# EAGLE design vga (EAGLE 6.5.0)
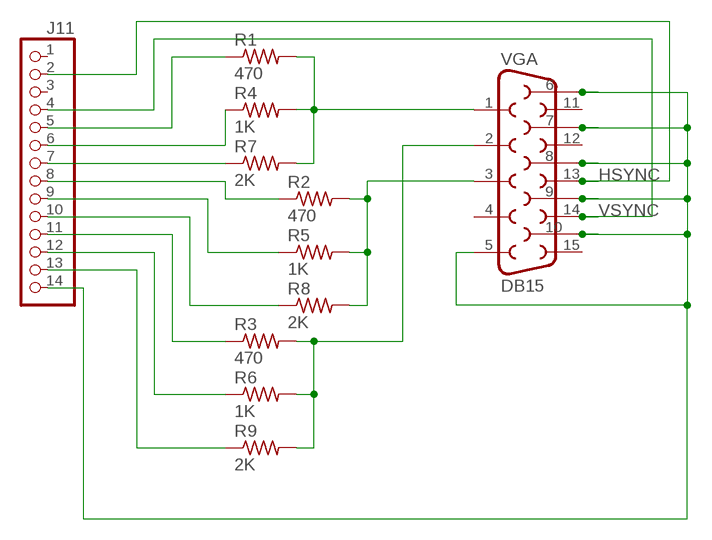
[diagram p0: schematic, sheet 1]

## Parts
J11  PINHD-1X14  [1X14]
R1  470  R-US_R0805  [R0805]
R2  470  R-US_R0805  [R0805]
R3  470  R-US_R0805  [R0805]
R4  1K  R-US_R0805  [R0805]
R5  1K  R-US_R0805  [R0805]
R6  1K  R-US_R0805  [R0805]
R7  2K  R-US_R0805  [R0805]
R8  2K  R-US_R0805  [R0805]
R9  2K  R-US_R0805  [R0805]
VGA  DB15  [DB15]

## Nets
BLUE: R3.2 R6.2 R9.2 VGA.2
EXT1: J11.5 R1.1
EXT7: J11.6 R4.1
EXT13: J11.8 R2.1
EXT16: J11.9 R5.1
EXT19: J11.10 R8.1
EXT22: J11.11 R3.1
EXT25: J11.12 R6.1
EXT28: J11.13 R9.1
GREEN: R2.2 R5.2 R8.2 VGA.3
HSYNC: J11.2 VGA.13
N$1: J11.14 VGA.5 VGA.6 VGA.7 VGA.8 VGA.9 VGA.10
N$2: J11.7 R7.1
RED: R1.2 R4.2 R7.2 VGA.1
VSYNC: J11.4 VGA.14
Unconnected: J11.1 J11.3 VGA.4 VGA.11 VGA.12 VGA.15

## Library data of the parts
J11 = pinhead:PINHD-1X14: PIN HEADER
R1-R9 = rcl:R-US_: RESISTOR, American symbol
VGA = SparkFun-Connectors:DB15: DB15 / VGA right angle through-hole female connector.

## Board
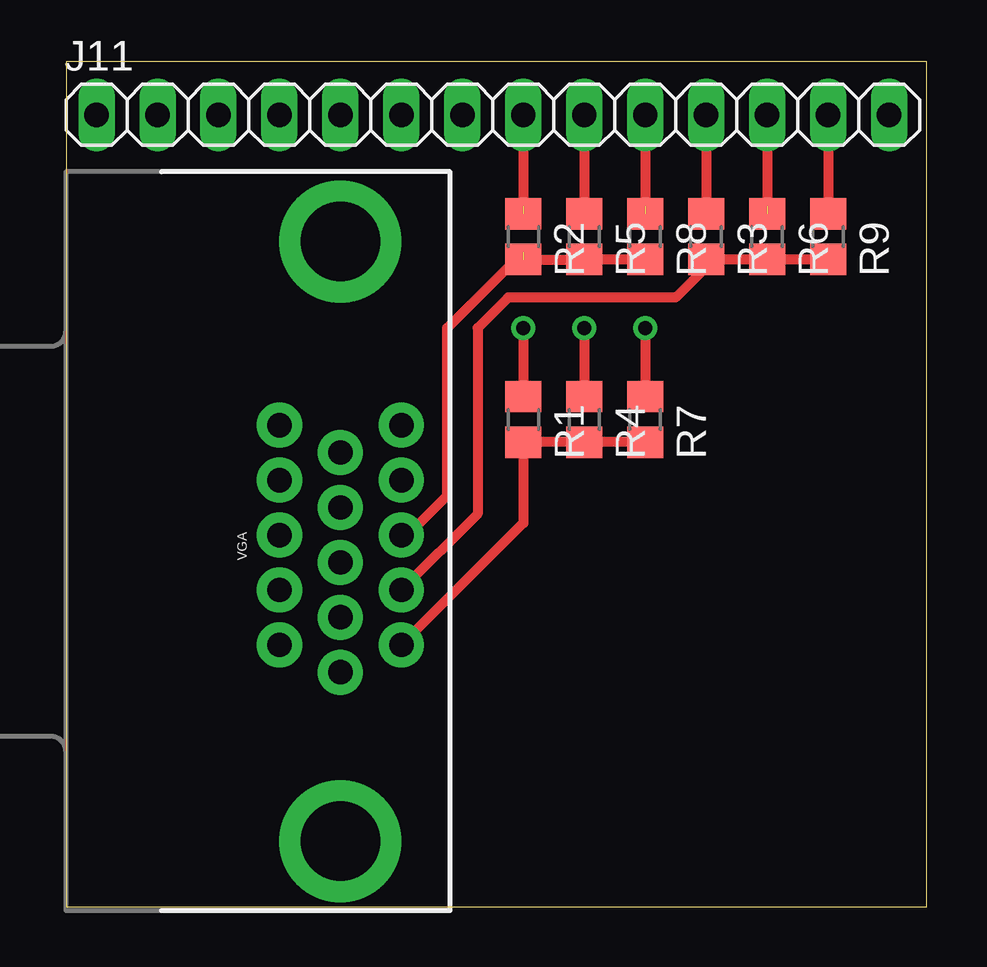
[diagram p1: board, top side]
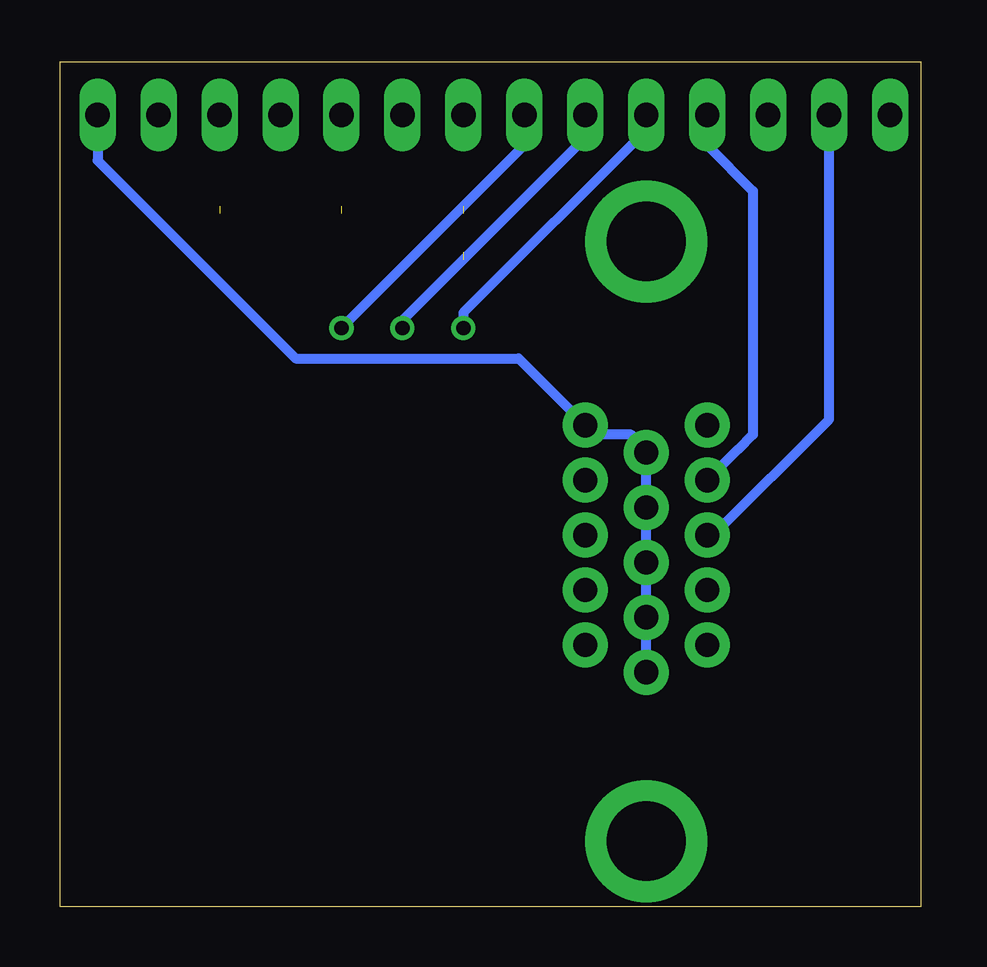
[diagram p2: board, bottom side, seen from below]

Size 35.86 x 35.23 mm. Coordinates in mm from the lower left corner, seen from the top.
Outline: 0,0 35.86,0 35.86,35.23 0,35.23 0,0
Copper layers (1*16): Top 0.035mm / dielectric 1.5mm / Bottom 0.035mm
Design rules "default": minimum track width 10mil, minimum drill 24mil, track to track 8mil, track to pad 8mil, pad to pad 8mil, via to via 8mil, smd to smd 8mil, copper to edge 40mil, drill to drill 8mil, minimum pad ring 10mil, minimum via ring 8mil, stop-mask expansion 4mil, vias tented up to drill 0mil, thermal gap 10mil

### Footprints (pad centres in the part's own frame; a part is rotated, then mirrored left to right if it is on the bottom)
1X14 = drill 1.016 long: 1 -16.51,0; 2 -13.97,0; 3 -11.43,0; 4 -8.89,0; 5 -6.35,0; 6 -3.81,0; 7 -1.27,0; 8 1.27,0; 9 3.81,0; 10 6.35,0; 11 8.89,0; 12 11.43,0; 13 13.97,0; 14 16.51,0
R0805 = smd 1.3 x 1.5: 1 -0.95,0; 2 0.95,0
DB15 = drill 1.016 pad 1.88: 1 -4.32,-7.62; 2 -2.03,-7.62; 3 0.26,-7.62; 4 2.55,-7.62; 5 4.84,-7.62; 6 -5.46,-5.08; 7 -3.17,-5.08; 8 -0.88,-5.08; 9 1.41,-5.08; 10 3.7,-5.08; 11 -4.32,-2.54; 12 -2.03,-2.54; 13 0.26,-2.54; 14 2.55,-2.54; 15 4.84,-2.54 | drill 3.302 pad 5.08: G1 -12.5,-5.08; G2 12.5,-5.08

### Placement (x,y rotation side)
J11  17.78,33.02 0 top
R1  19.05,20.32 270 top
R2  19.05,27.94 270 top
R3  26.67,27.94 270 top
R4  21.59,20.32 270 top
R5  21.59,27.94 270 top
R6  29.21,27.94 270 top
R7  24.13,20.32 270 top
R8  24.13,27.94 270 top
R9  31.75,27.94 270 top
VGA  6.35,15.24 90 top

### Tracks (layer width: path | path; a pad name or v marks a point on that pad's centre or on a via)
BLUE
  Top 0.406: R9.2 R6.2 R3.2 26.67,26.67 25.4,25.4 18.41,25.4 17.14,24.13 17.14,16.39 VGA.2
EXT1  (via drill 0.6)
  Top 0.406: v19.05,24.13 R1.1
  Bottom 0.406: J11.5 11.43,32.38 19.05,24.77 v19.05,24.13
EXT7  (via drill 0.6)
  Top 0.406: v21.59,24.13 R4.1
  Bottom 0.406: v21.59,24.13 21.59,24.45 13.97,32.07 J11.6
EXT13  (1 unrouted)
  Top 0.406: J11.8 19.05,29.21
EXT16
  Top 0.406: J11.9 R5.1
EXT19  (1 unrouted)
  Top 0.406: J11.10 24.13,29.21
EXT22
  Top 0.406: J11.11 R3.1
EXT25  (1 unrouted)
  Top 0.406: J11.12 29.21,29.21
EXT28
  Top 0.406: J11.13 R9.1
GREEN  (1 unrouted)
  Top 0.406: VGA.3 14.23,15.5 15.88,17.14 15.88,24.13 19.05,27.3 | R2.2 R5.2 R8.2
HSYNC
  Bottom 0.406: VGA.13 8.63,15.5 3.81,20.32 J11.2
N$1
  Bottom 0.406: VGA.6 VGA.7 VGA.8 VGA.9 VGA.10 11.43,19.05 12.06,19.68 13.57,19.68 VGA.5 16.75,22.86 26.04,22.86 34.29,31.11 J11.14
N$2  (via drill 0.6)
  Top 0.406: v24.13,24.13 R7.1
  Bottom 0.406: J11.7 16.51,31.75 v24.13,24.13
RED
  Top 0.406: R7.2 R4.2 R1.2 19.05,16 VGA.1
VSYNC
  Bottom 0.406: J11.4 8.89,31.75 6.99,29.84 6.99,19.68 7.62,19.05 7.63,19.05 VGA.14